# Altium schematic sheet Main IF Board A.SchDoc: Up/Down Converter SOM Header
size A4
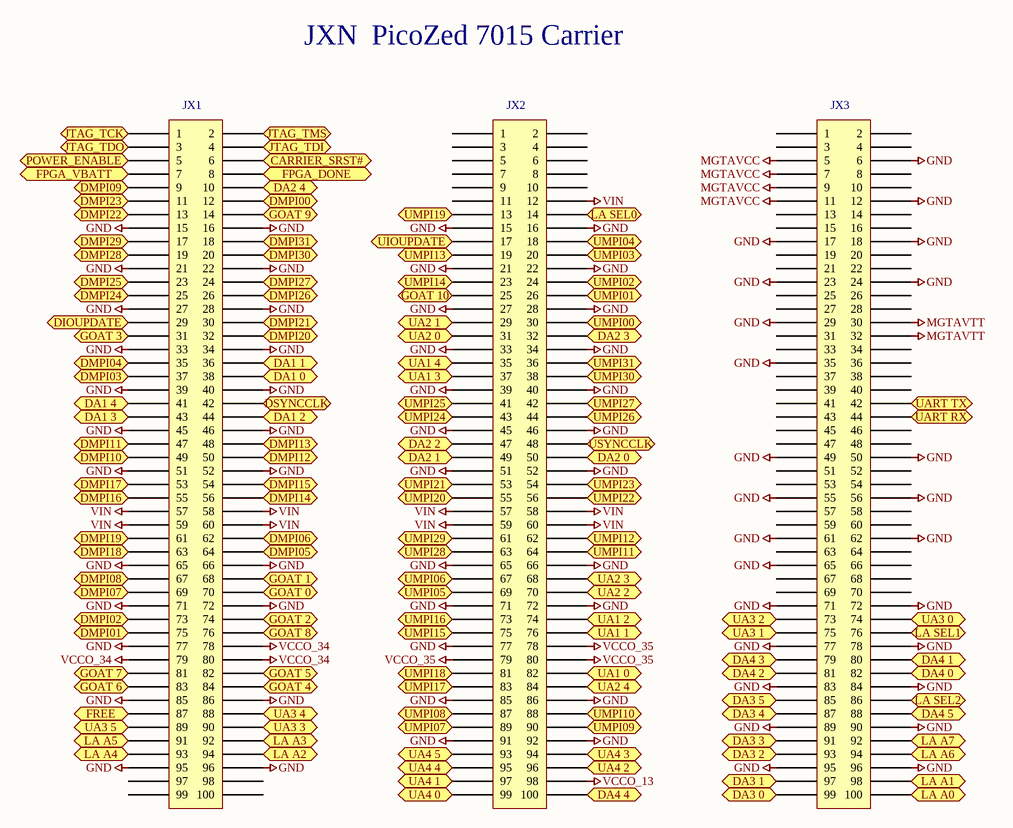
[diagram p0: Main IF Board A.SchDoc]

## Parts
JXN  PicoZed 7015 Carrier  [BergStak61083]

## Ports
CARRIER_SRST# (bidir), DA1 0 (bidir), DA1 1 (bidir), DA1 2 (bidir), DA1 3 (bidir), DA1 4 (bidir), DA2 0 (bidir), DA2 1 (bidir), DA2 2 (bidir), DA2 3 (bidir), DA2 4 (bidir), DA3 0 (bidir), DA3 1 (bidir), DA3 2 (bidir), DA3 3 (bidir), DA3 4 (bidir), DA3 5 (bidir), DA4 0 (bidir), DA4 1 (bidir), DA4 2 (bidir), DA4 3 (bidir), DA4 4 (bidir), DA4 5 (bidir), DIOUPDATE (bidir), DMPI00 (bidir), DMPI01 (bidir), DMPI02 (bidir), DMPI03 (bidir), DMPI04 (bidir), DMPI05 (bidir), DMPI06 (bidir), DMPI07 (bidir), DMPI08 (bidir), DMPI09 (bidir), DMPI10 (bidir), DMPI11 (bidir), DMPI12 (bidir), DMPI13 (bidir), DMPI14 (bidir), DMPI15 (bidir), DMPI16 (bidir), DMPI17 (bidir), DMPI18 (bidir), DMPI19 (bidir), DMPI20 (bidir), DMPI21 (bidir), DMPI22 (bidir), DMPI23 (bidir), DMPI24 (bidir), DMPI25 (bidir), DMPI26 (bidir), DMPI27 (bidir), DMPI28 (bidir), DMPI29 (bidir), DMPI30 (bidir), DMPI31 (bidir), DSYNCCLK (bidir), FPGA_DONE (bidir), FPGA_VBATT (bidir), FREE (bidir), GOAT 0 (bidir), GOAT 1 (bidir), GOAT 2 (bidir), GOAT 3 (bidir), GOAT 4 (bidir), GOAT 5 (bidir), GOAT 6 (bidir), GOAT 7 (bidir), GOAT 8 (bidir), GOAT 9 (bidir), GOAT 10 (bidir), JTAG_TCK (bidir), JTAG_TDI (bidir), JTAG_TDO (bidir), JTAG_TMS (bidir), LA A0 (bidir), LA A1 (bidir), LA A2 (bidir), LA A3 (bidir), LA A4 (bidir), LA A5 (bidir), LA A6 (bidir), LA A7 (bidir), LA SEL0 (bidir), LA SEL1 (bidir), LA SEL2 (bidir), POWER_ENABLE (bidir), UA1 0 (bidir), UA1 1 (bidir), UA1 2 (bidir), UA1 3 (bidir), UA1 4 (bidir), UA2 0 (bidir), UA2 1 (bidir), UA2 2 (bidir), UA2 3 (bidir), UA2 4 (bidir), UA3 0 (bidir), UA3 1 (bidir), UA3 2 (bidir), UA3 3 (bidir), UA3 4 (bidir), UA3 5 (bidir), UA4 0 (bidir), UA4 1 (bidir), UA4 2 (bidir), UA4 3 (bidir), UA4 4 (bidir), UA4 5 (bidir), UART RX (bidir), UART TX (bidir), UIOUPDATE (bidir), UMPI00 (bidir), UMPI01 (bidir), UMPI02 (bidir), UMPI03 (bidir), UMPI04 (bidir), UMPI05 (bidir), UMPI06 (bidir), UMPI07 (bidir), UMPI08 (bidir), UMPI09 (bidir), UMPI10 (bidir), UMPI11 (bidir), UMPI12 (bidir), UMPI13 (bidir), UMPI14 (bidir), UMPI15 (bidir), UMPI16 (bidir), UMPI17 (bidir), UMPI18 (bidir), UMPI19 (bidir), UMPI20 (bidir), UMPI21 (bidir), UMPI22 (bidir), UMPI23 (bidir), UMPI24 (bidir), UMPI25 (bidir), UMPI26 (bidir), UMPI27 (bidir), UMPI28 (bidir), UMPI29 (bidir), UMPI30 (bidir), UMPI31 (bidir), USYNCCLK (bidir)

## Nets
GND: JXN.115(15) JXN.116(16) JXN.121(21) JXN.122(22) JXN.127(27) JXN.128(28) JXN.133(33) JXN.134(34) JXN.139(39) JXN.140(40) JXN.145(45) JXN.146(46) JXN.151(51) JXN.152(52) JXN.165(65) JXN.166(66) JXN.171(71) JXN.172(72) JXN.177(77) JXN.185(85) JXN.186(86) JXN.195(95) JXN.196(96) JXN.215(15) JXN.216(16) JXN.221(21) JXN.222(22) JXN.227(27) JXN.228(28) JXN.233(33) JXN.234(34) JXN.239(39) JXN.240(40) JXN.245(45) JXN.246(46) JXN.251(51) JXN.252(52) JXN.265(65) JXN.266(66) JXN.271(71) JXN.272(72) JXN.277(77) JXN.285(85) JXN.286(86) JXN.291(91) JXN.292(92) JXN.306(6) JXN.312(12) JXN.317(17) JXN.318(18) JXN.323(23) JXN.324(24) JXN.329(29) JXN.335(35) JXN.349(49) JXN.350(50) JXN.355(55) JXN.356(56) JXN.361(61) JXN.362(62) JXN.365(65) JXN.371(71) JXN.372(72) JXN.377(77) JXN.378(78) JXN.383(83) JXN.384(84) JXN.389(89) JXN.390(90) JXN.395(95) JXN.396(96)
MGTAVCC: JXN.305(5) JXN.307(7) JXN.309(9) JXN.311(11)
MGTAVTT: JXN.330(30) JXN.332(32)
VCCO_13: JXN.298(98)
VCCO_34: JXN.178(78) JXN.179(79) JXN.180(80)
VCCO_35: JXN.278(78) JXN.279(79) JXN.280(80)
VIN: JXN.157(57) JXN.158(58) JXN.159(59) JXN.160(60) JXN.212(12) JXN.257(57) JXN.258(58) JXN.259(59) JXN.260(60)
CARRIER_SRST#: JXN.106(6) ; port CARRIER_SRST#
DA1 0: JXN.138(38) ; port DA1 0
DA1 1: JXN.136(36) ; port DA1 1
DA1 2: JXN.144(44) ; port DA1 2
DA1 3: JXN.143(43) ; port DA1 3
DA1 4: JXN.141(41) ; port DA1 4
DA2 0: JXN.250(50) ; port DA2 0
DA2 1: JXN.249(49) ; port DA2 1
DA2 2: JXN.247(47) ; port DA2 2
DA2 3: JXN.232(32) ; port DA2 3
DA2 4: JXN.110(10) ; port DA2 4
DA3 0: JXN.399(99) ; port DA3 0
DA3 1: JXN.397(97) ; port DA3 1
DA3 2: JXN.393(93) ; port DA3 2
DA3 3: JXN.391(91) ; port DA3 3
DA3 4: JXN.387(87) ; port DA3 4
DA3 5: JXN.385(85) ; port DA3 5
DA4 0: JXN.382(82) ; port DA4 0
DA4 1: JXN.380(80) ; port DA4 1
DA4 2: JXN.381(81) ; port DA4 2
DA4 3: JXN.379(79) ; port DA4 3
DA4 4: JXN.300(100) ; port DA4 4
DA4 5: JXN.388(88) ; port DA4 5
DIOUPDATE: JXN.129(29) ; port DIOUPDATE
DMPI00: JXN.112(12) ; port DMPI00
DMPI01: JXN.175(75) ; port DMPI01
DMPI02: JXN.173(73) ; port DMPI02
DMPI03: JXN.137(37) ; port DMPI03
DMPI04: JXN.135(35) ; port DMPI04
DMPI05: JXN.164(64) ; port DMPI05
DMPI06: JXN.162(62) ; port DMPI06
DMPI07: JXN.169(69) ; port DMPI07
DMPI08: JXN.167(67) ; port DMPI08
DMPI09: JXN.109(9) ; port DMPI09
DMPI10: JXN.149(49) ; port DMPI10
DMPI11: JXN.147(47) ; port DMPI11
DMPI12: JXN.150(50) ; port DMPI12
DMPI13: JXN.148(48) ; port DMPI13
DMPI14: JXN.156(56) ; port DMPI14
DMPI15: JXN.154(54) ; port DMPI15
DMPI16: JXN.155(55) ; port DMPI16
DMPI17: JXN.153(53) ; port DMPI17
DMPI18: JXN.163(63) ; port DMPI18
DMPI19: JXN.161(61) ; port DMPI19
DMPI20: JXN.132(32) ; port DMPI20
DMPI21: JXN.130(30) ; port DMPI21
DMPI22: JXN.113(13) ; port DMPI22
DMPI23: JXN.111(11) ; port DMPI23
DMPI24: JXN.125(25) ; port DMPI24
DMPI25: JXN.123(23) ; port DMPI25
DMPI26: JXN.126(26) ; port DMPI26
DMPI27: JXN.124(24) ; port DMPI27
DMPI28: JXN.119(19) ; port DMPI28
DMPI29: JXN.117(17) ; port DMPI29
DMPI30: JXN.120(20) ; port DMPI30
DMPI31: JXN.118(18) ; port DMPI31
DSYNCCLK: JXN.142(42) ; port DSYNCCLK
FPGA_DONE: JXN.108(8) ; port FPGA_DONE
FPGA_VBATT: JXN.107(7) ; port FPGA_VBATT
FREE: JXN.187(87) ; port FREE
GOAT 0: JXN.170(70) ; port GOAT 0
GOAT 1: JXN.168(68) ; port GOAT 1
GOAT 2: JXN.174(74) ; port GOAT 2
GOAT 3: JXN.131(31) ; port GOAT 3
GOAT 4: JXN.184(84) ; port GOAT 4
GOAT 5: JXN.182(82) ; port GOAT 5
GOAT 6: JXN.183(83) ; port GOAT 6
GOAT 7: JXN.181(81) ; port GOAT 7
GOAT 8: JXN.176(76) ; port GOAT 8
GOAT 9: JXN.114(14) ; port GOAT 9
GOAT 10: JXN.225(25) ; port GOAT 10
JTAG_TCK: JXN.101(1) ; port JTAG_TCK
JTAG_TDI: JXN.104(4) ; port JTAG_TDI
JTAG_TDO: JXN.103(3) ; port JTAG_TDO
JTAG_TMS: JXN.102(2) ; port JTAG_TMS
LA A0: JXN.400(100) ; port LA A0
LA A1: JXN.398(98) ; port LA A1
LA A2: JXN.194(94) ; port LA A2
LA A3: JXN.192(92) ; port LA A3
LA A4: JXN.193(93) ; port LA A4
LA A5: JXN.191(91) ; port LA A5
LA A6: JXN.394(94) ; port LA A6
LA A7: JXN.392(92) ; port LA A7
LA SEL0: JXN.214(14) ; port LA SEL0
LA SEL1: JXN.376(76) ; port LA SEL1
LA SEL2: JXN.386(86) ; port LA SEL2
POWER_ENABLE: JXN.105(5) ; port POWER_ENABLE
UA1 0: JXN.282(82) ; port UA1 0
UA1 1: JXN.276(76) ; port UA1 1
UA1 2: JXN.274(74) ; port UA1 2
UA1 3: JXN.237(37) ; port UA1 3
UA1 4: JXN.235(35) ; port UA1 4
UA2 0: JXN.231(31) ; port UA2 0
UA2 1: JXN.229(29) ; port UA2 1
UA2 2: JXN.270(70) ; port UA2 2
UA2 3: JXN.268(68) ; port UA2 3
UA2 4: JXN.284(84) ; port UA2 4
UA3 0: JXN.374(74) ; port UA3 0
UA3 1: JXN.375(75) ; port UA3 1
UA3 2: JXN.373(73) ; port UA3 2
UA3 3: JXN.190(90) ; port UA3 3
UA3 4: JXN.188(88) ; port UA3 4
UA3 5: JXN.189(89) ; port UA3 5
UA4 0: JXN.299(99) ; port UA4 0
UA4 1: JXN.297(97) ; port UA4 1
UA4 2: JXN.296(96) ; port UA4 2
UA4 3: JXN.294(94) ; port UA4 3
UA4 4: JXN.295(95) ; port UA4 4
UA4 5: JXN.293(93) ; port UA4 5
UART RX: JXN.344(44) ; port UART RX
UART TX: JXN.342(42) ; port UART TX
UIOUPDATE: JXN.217(17) ; port UIOUPDATE
UMPI00: JXN.230(30) ; port UMPI00
UMPI01: JXN.226(26) ; port UMPI01
UMPI02: JXN.224(24) ; port UMPI02
UMPI03: JXN.220(20) ; port UMPI03
UMPI04: JXN.218(18) ; port UMPI04
UMPI05: JXN.269(69) ; port UMPI05
UMPI06: JXN.267(67) ; port UMPI06
UMPI07: JXN.289(89) ; port UMPI07
UMPI08: JXN.287(87) ; port UMPI08
UMPI09: JXN.290(90) ; port UMPI09
UMPI10: JXN.288(88) ; port UMPI10
UMPI11: JXN.264(64) ; port UMPI11
UMPI12: JXN.262(62) ; port UMPI12
UMPI13: JXN.219(19) ; port UMPI13
UMPI14: JXN.223(23) ; port UMPI14
UMPI15: JXN.275(75) ; port UMPI15
UMPI16: JXN.273(73) ; port UMPI16
UMPI17: JXN.283(83) ; port UMPI17
UMPI18: JXN.281(81) ; port UMPI18
UMPI19: JXN.213(13) ; port UMPI19
UMPI20: JXN.255(55) ; port UMPI20
UMPI21: JXN.253(53) ; port UMPI21
UMPI22: JXN.256(56) ; port UMPI22
UMPI23: JXN.254(54) ; port UMPI23
UMPI24: JXN.243(43) ; port UMPI24
UMPI25: JXN.241(41) ; port UMPI25
UMPI26: JXN.244(44) ; port UMPI26
UMPI27: JXN.242(42) ; port UMPI27
UMPI28: JXN.263(63) ; port UMPI28
UMPI29: JXN.261(61) ; port UMPI29
UMPI30: JXN.238(38) ; port UMPI30
UMPI31: JXN.236(36) ; port UMPI31
USYNCCLK: JXN.248(48) ; port USYNCCLK

Not connected (* = marked no-connect by the designer): JXN 197(97) 198(98) 199(99) 200(100) 201(1) 202(2) 203(3) 204(4) 205(5) 206(6) 207(7) 208(8) 209(9) 210(10) 211(11) 301(1) 302(2) 303(3) 304(4) 308(8) 310(10) 313(13) 314(14) 315(15) 316(16) 319(19) 320(20) 321(21) 322(22) 325(25) 326(26) 327(27) 328(28) 331(31) 333(33) 334(34) 336(36) 337(37) 338(38) 339(39) 340(40) 341(41) 343(43) 345(45) 346(46) 347(47) 348(48) 351(51) 352(52) 353(53) 354(54) 357(57) 358(58) 359(59) 360(60) 363(63) 364(64) 366(66) 367(67) 368(68) 369(69) 370(70)

## Notes on the sheet
- (in symbol PicoZed7015 Carrier) JX1; JX2; JX3

## Library data of the parts
JXN = PicoZed7015 Carrier